# EAGLE design shield_SIM7000E (EAGLE 7.5.0)
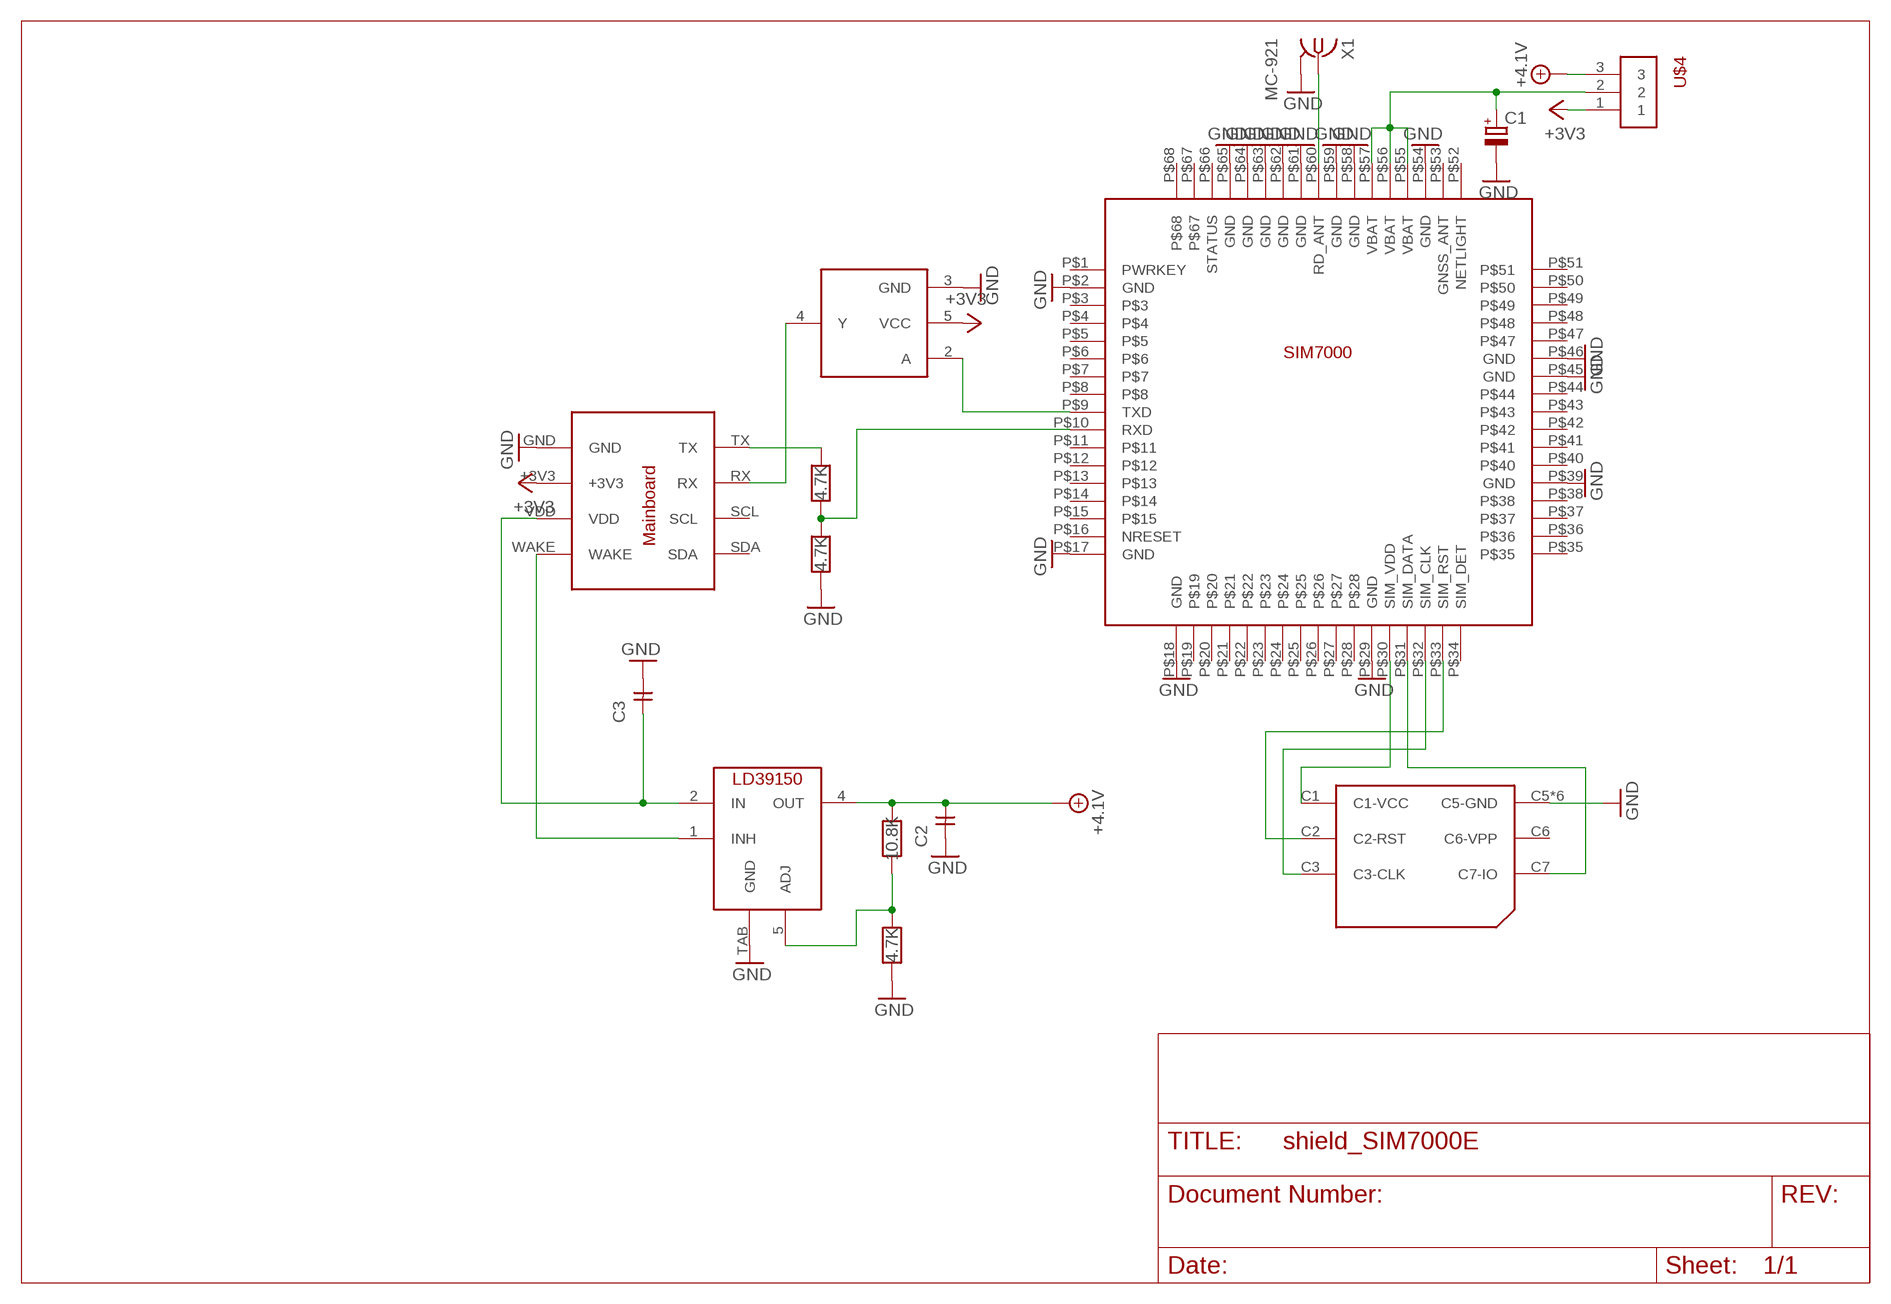
[diagram p0: schematic, sheet 1]

## Parts
C1  CPOL-EUE5-13  [E5-13]
C2  CSMD_1206  [SMD_RC_1206]
C3  CSMD_1206  [SMD_RC_1206]
R1  10.8K  RSMD_1206  [SMD_RC_1206]
R2  4.7K  RSMD_1206  [SMD_RC_1206]
R3  4.7K  RSMD_1206  [SMD_RC_1206]
R4  4.7K  RSMD_1206  [SMD_RC_1206]
U$1  SHIELD  [SHIELD]
U$2  LD39150PT-R  [PPAK]
U$3  SIM7000  [SIM7000]
U$4  HEADER_1X3  [HEADER_1X3]
U$5  SN75LV1T34  [SOT23-5L-SIMPLE]
U$6  SIM_SCYT  [SIM_SCYT]
X1  MC-921  [MC-921]

## Nets
+3V3: U$1.+3V3 U$4.1 U$5.5(VCC)
+4.1V: C2.P$2 R1.P$1 U$2.4(OUT) U$4.3
GND: C1.- C2.P$1 C3.P$2 R2.P$2 R4.P$1 U$1.GND U$2.TAB(GND) U$3.P$2(GND) U$3.P$17(GND) U$3.P$18(GND) U$3.P$29(GND) U$3.P$39(GND) U$3.P$45(GND) U$3.P$46(GND) U$3.P$54(GND) U$3.P$58(GND) U$3.P$59(GND) U$3.P$61(GND) U$3.P$62(GND) U$3.P$63(GND) U$3.P$64(GND) U$3.P$65(GND) U$5.3(GND) U$6.C5(C5-GND) U$6.GND@1(C5-GND) U$6.GND@2(C5-GND) U$6.GND@3(C5-GND) U$6.GND@4(C5-GND) U$6.GND@5(C5-GND) X1.2@1(GND) X1.2@2(GND)
N$1: R3.P$2 U$1.TX
N$2: C1.+ U$3.P$55(VBAT) U$3.P$56(VBAT) U$3.P$57(VBAT) U$4.2
N$3: R1.P$2 R2.P$1 U$2.5(ADJ)
N$4: C3.P$1 U$1.VDD U$2.2(IN)
N$6: U$1.WAKE U$2.1(INH)
N$7: U$3.P$9(TXD) U$5.2(A)
N$8: R3.P$1 R4.P$2 U$3.P$10(RXD)
N$9: U$1.RX U$5.4(Y)
N$10: U$3.P$30(SIM_VDD) U$6.C1(C1-VCC)
N$11: U$3.P$31(SIM_DATA) U$6.C7(C7-IO)
N$12: U$3.P$32(SIM_CLK) U$6.C3(C3-CLK)
N$13: U$3.P$33(SIM_RST) U$6.C2(C2-RST)
N$14: U$3.P$60(RD_ANT) X1.1
Unconnected: U$1.SCL U$1.SDA U$3.P$1(PWRKEY) U$3.P$3 U$3.P$4 U$3.P$5 U$3.P$6 U$3.P$7 U$3.P$8 U$3.P$11 U$3.P$12 U$3.P$13 U$3.P$14 U$3.P$15 U$3.P$16(NRESET) U$3.P$19 U$3.P$20 U$3.P$21 U$3.P$22 U$3.P$23 U$3.P$24 U$3.P$25 U$3.P$26 U$3.P$27 U$3.P$28 U$3.P$34(SIM_DET) U$3.P$35 U$3.P$36 U$3.P$37 U$3.P$38 U$3.P$40 U$3.P$41 U$3.P$42 U$3.P$43 U$3.P$44 U$3.P$47 U$3.P$48 U$3.P$49 U$3.P$50 U$3.P$51 U$3.P$52(NETLIGHT) U$3.P$53(GNSS_ANT) U$3.P$66(STATUS) U$3.P$67 U$3.P$68 U$6.C6(C6-VPP)

## Library data of the parts
C1 = rcl:CPOL-EU: POLARIZED CAPACITOR, European symbol
C2 C3 = balance:C
R1-R4 = balance:R
U$1 = balance:SHIELD
U$2 = balance:LD39150PT-R
U$3 = balance:SIM7000
U$4 = balance:HEADER_1X3
U$5 = balance:SN75LV1T34
U$6 = balance:SIM_SCYT
X1 = con-coax:MC-921: COAX. MICROWAVE CONNECTOR O/D diam 2.1 Source: www.tycoelectronics.com .. Electronics .. ENG_CD_1775146_A2.pdf; OC_FARNELL: unknown; OC_NEWARK: unknown

## Net classes
0 default: clearance 0.205 mm

## Board
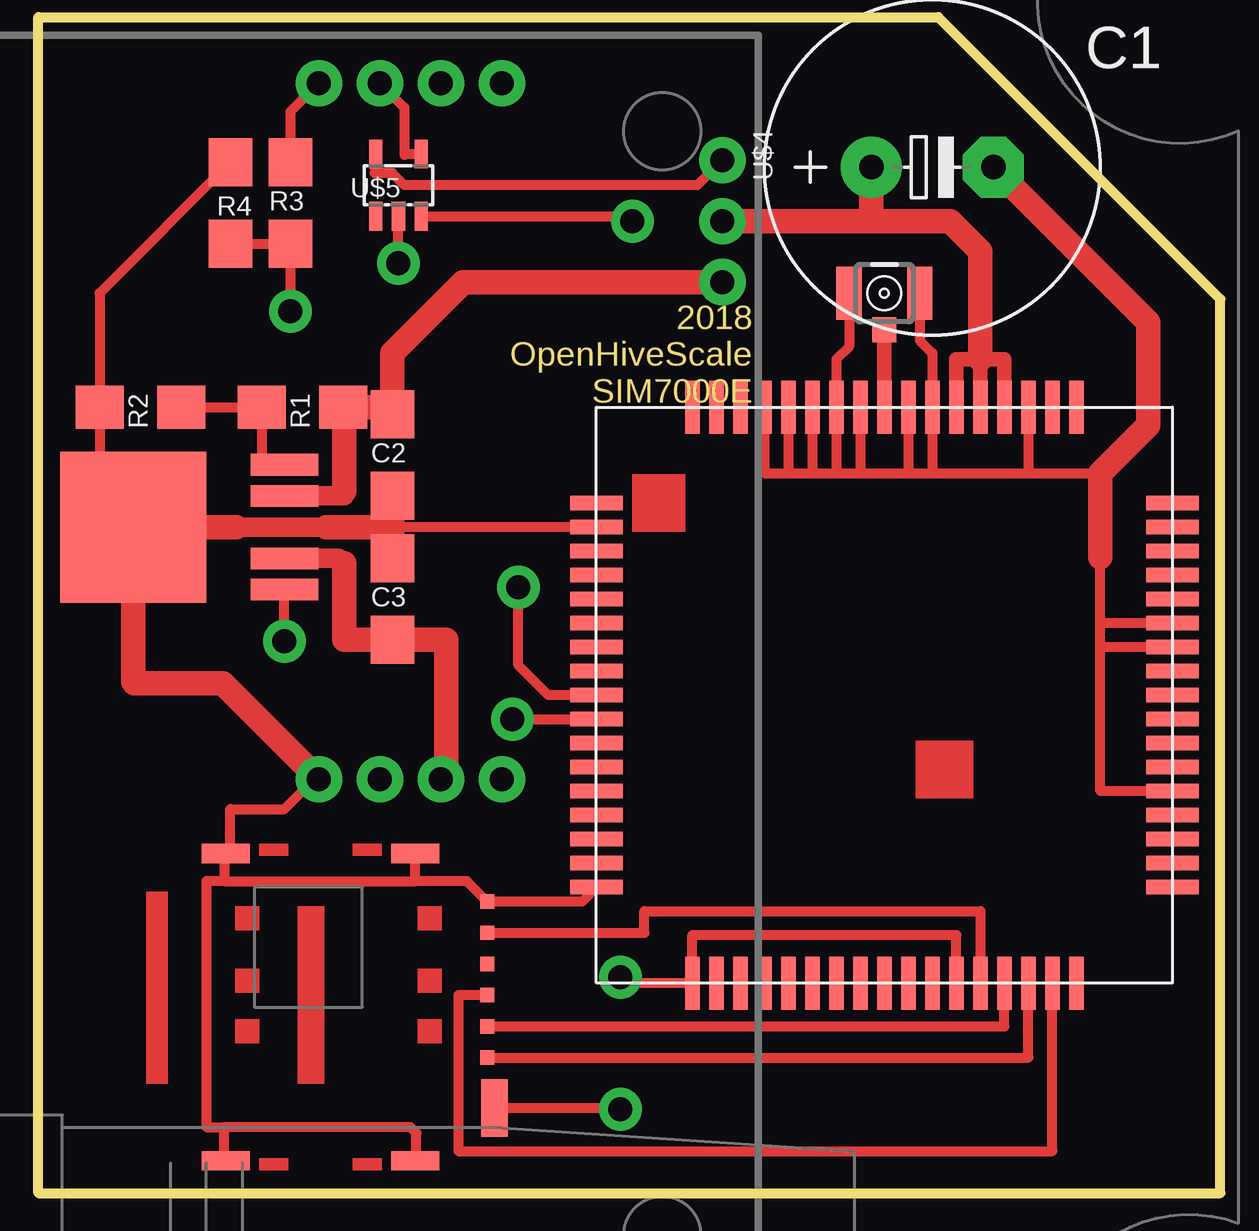
[diagram p1: board, top side]
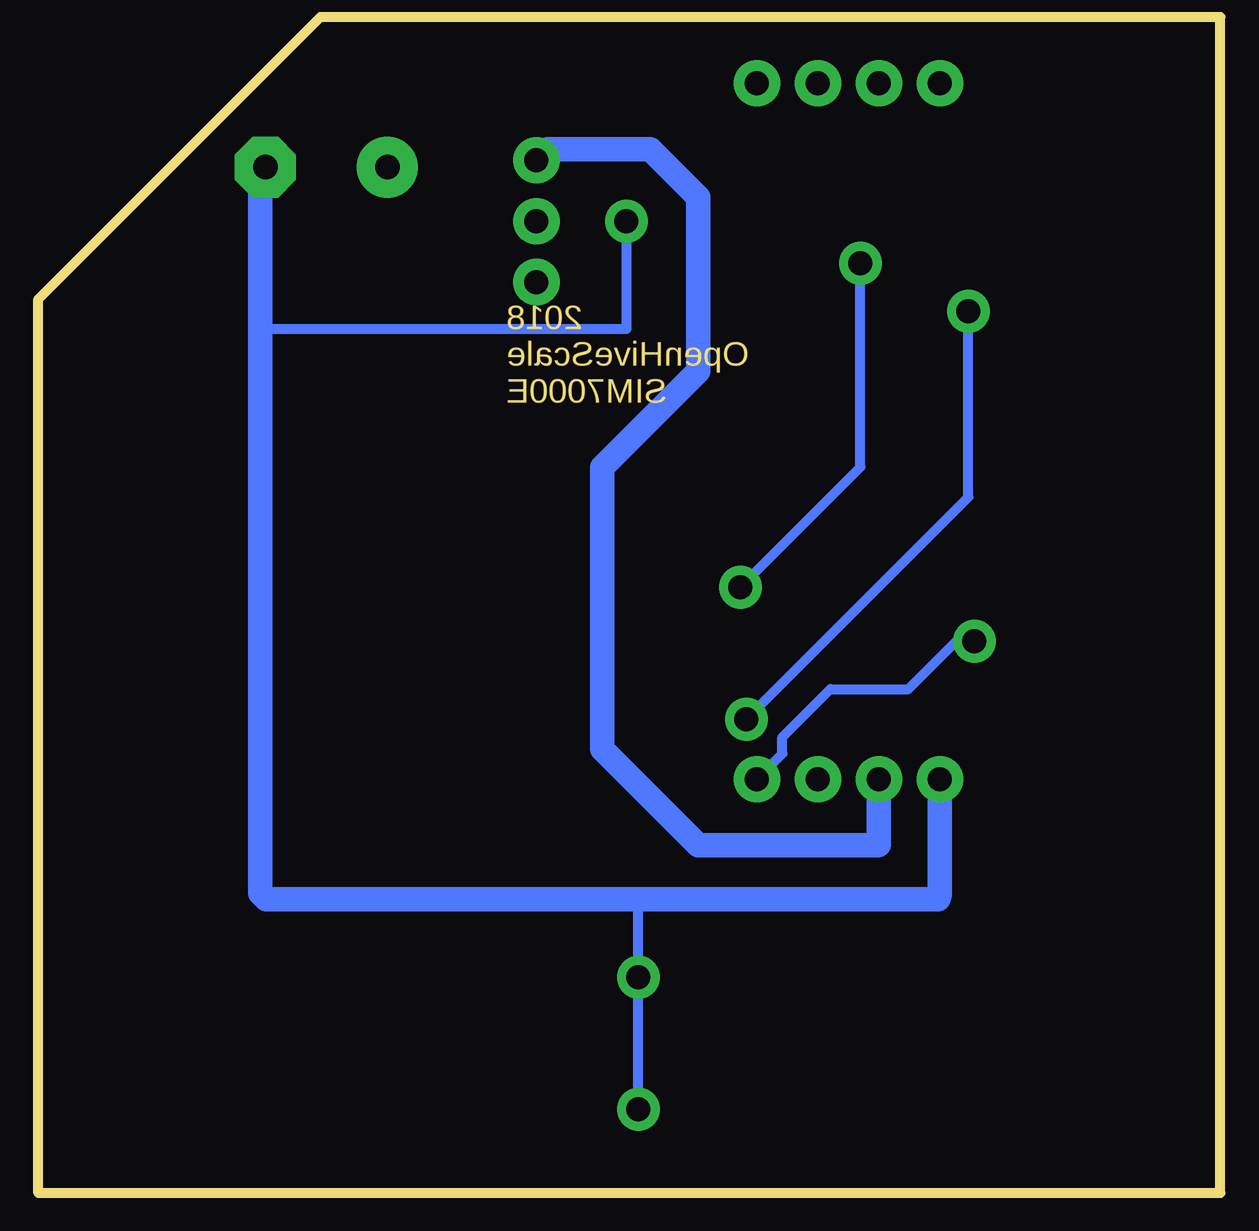
[diagram p2: board, bottom side, seen from below]

No outline drawn. Coordinates in mm, seen from the top.
Copper layers (1*16): Top 0.035mm / dielectric 1.5mm / Bottom 0.035mm
Design rules "SeeedStudio_2layer_DRU_no_angle_20140221": minimum track width 6mil, minimum drill 12mil, track to track 6mil, track to pad 6mil, pad to pad 6mil, via to via 6mil, smd to smd 0mil, copper to edge 10mil, drill to drill 10mil, minimum pad ring 10mil, minimum via ring 6mil, stop-mask expansion 2mil, vias tented up to drill 100mil, thermal gap 10mil
Milling: 5 lines

### Footprints (pad centres in the part's own frame; a part is rotated, then mirrored left to right if it is on the bottom)
E5-13 = drill 1.016 pad 2.54: + -2.54,0 | drill 1.016 pad 2.54 octagon: - 2.54,0
SMD_RC_1206 = smd 2 x 1.8: P$1 -1.7,0; P$2 1.7,0
SHIELD = drill 1 pad 1.93: +3V3 36.73,23; GND 34.19,23; RX 36.73,52; SCL 39.27,52; SDA 41.81,52; TX 34.19,52; VDD 39.27,23; WAKE 41.81,23
PPAK = smd 0.9 x 2.8: 1 -2.6,-4; 2 -1.3,-4; 4 1.3,-4; 5 2.6,-4 | smd 6.3 x 6.1: TAB 0,2.3
SIM7000 = smd 2.2 x 0.6: P$1 -12,8; P$2 -12,7; P$3 -12,6; P$4 -12,5; P$5 -12,4; P$6 -12,3; P$7 -12,2; P$8 -12,1; P$9 -12,0; P$10 -12,-1; P$11 -12,-2; P$12 -12,-3; P$13 -12,-4; P$14 -12,-5; P$15 -12,-6; P$16 -12,-7; P$17 -12,-8; P$35 12,-8; P$36 12,-7; P$37 12,-6; P$38 12,-5; P$39 12,-4; P$40 12,-3; P$41 12,-2; P$42 12,-1; P$43 12,0; P$44 12,1; P$45 12,2; P$46 12,3; P$47 12,4; P$48 12,5; P$49 12,6; P$50 12,7; P$51 12,8 | smd 0.6 x 2.2: P$18 -8,-12; P$19 -7,-12; P$20 -6,-12; P$21 -5,-12; P$22 -4,-12; P$23 -3,-12; P$24 -2,-12; P$25 -1,-12; P$26 0,-12; P$27 1,-12; P$28 2,-12; P$29 3,-12; P$30 4,-12; P$31 5,-12; P$32 6,-12; P$33 7,-12; P$34 8,-12; P$52 8,12; P$53 7,12; P$54 6,12; P$55 5,12; P$56 4,12; P$57 3,12; P$58 2,12; P$59 1,12; P$60 0,12; P$61 -1,12; P$62 -2,12; P$63 -3,12; P$64 -4,12; P$65 -5,12; P$66 -6,12; P$67 -7,12; P$68 -8,12
HEADER_1X3 = drill 1 pad 1.93: 1 -2.54,0; 2 0,0; 3 2.54,0
SOT23-5L-SIMPLE = smd 0.55 x 1.2: 1 -0.95,-1.3; 2 0,-1.3; 3 0.95,-1.3; 4 0.95,1.3; 5 -0.95,1.3
SIM_SCYT = smd 0.6 x 0.6: C1 -3.1,-0.3; C2 -0.5,-0.3; C3 2.1,-0.3; C5 -4.4,-0.3; C6 -1.8,-0.3; C7 0.8,-0.3 | smd 2.4 x 1.1: GND@1 4.2,0 | smd 0.8 x 2: GND@2 -6.4,-3.3; GND@3 6.4,-3.3; GND@4 -6.4,-11.2; GND@5 6.4,-11.2
MC-921 = smd 1 x 1.05: 1 0,1.528 | smd 1.05 x 2.2: 2@1 -1.475,0; 2@2 1.475,0

### Placement (x,y rotation side)
C1  37.25,42.75 0 top
C2  14.75,30.75 90 top
C3  14.75,24.75 90 top
R1  11,32.75 180 top
R2  4.25,32.75 180 top
R3  10.5,41.25 90 top
R4  8,41.25 270 top
U$1  -22.5,-5.75 0 top
U$2  6.25,27.75 90 top
U$3  35.25,20.75 0 top
U$4  28.5,40.5 270 top
U$5  15,42 0 top
U$6  19,7.75 270 top
X1  35.25,37.5 180 top

### Tracks (layer width: path | path; a pad name or v marks a point on that pad's centre or on a via)
+3V3
  Top 0.406: U$4.1 27.46,42 15.25,42 14.75,42.5 14,42.5 14.05,42.55 U$5.5
  Bottom 1.016: U$1.+3V3 14.23,14.52 14.25,14.5 21.75,14.5 25.75,18.5 25.75,30.25 21.75,34.25 21.75,41.5 23.75,43.5 28.04,43.5 U$4.1
+4.1V
  Top 0.813: 12.75,29.25 12.75,29.05 U$2.4
  Top 1.016: 12.75,29.25 12.75,32.5 12.7,32.5 R1.P$1 14.75,32.75 C2.P$2 14.75,35 17.71,37.96 U$4.3
GND  (via drill 1 pad 1.78)
  Top 0.406: 2.55,28 R2.P$2 2.55,37.5 R4.P$1 | 2.55,27.75 U$2.TAB | 7.75,13 7.75,14.1 U$6.GND@4 8,14.35 8,16 10.25,16 11.5,17.25 U$1.GND | 7.75,13 15.75,13 | 15.75,13 15.7,13.05 U$6.GND@2 | 15.75,13 17.85,13 U$6.C5 22.65,12.15 U$3.P$17 | U$6.GND@5 7.75,1.4 7.75,2.75 | U$6.GND@3 15.75,1.4 15.75,2.5 15.5,2.75 7.75,2.75 | U$3.P$46 44.25,23.75 | U$3.P$45 44.25,22.75 | 44.25,22.75 44.25,23.75 | U$3.P$39 44.25,16.75 44.25,22.75 | 44.25,23.75 44.25,26.5 | U$3.P$54 41.25,30 | 41.25,30 44,30 44.25,29.75 | 37.25,30 U$3.P$58 37.25,35 36.73,35.52 X1.2@1 | 37.25,30 41.25,30 | U$3.P$65 30.25,30 31.25,30 | 31.25,30 32.25,30 | 32.25,30 33.25,30 | 33.25,30 34.25,30 | 34.25,30 36.25,30 | U$3.P$64 31.25,30 | U$3.P$63 32.25,30 | 33.25,30 U$3.P$62 33.25,34.75 33.77,35.27 X1.2@2 | U$3.P$61 34.25,30 | U$3.P$59 36.25,30 | 36.25,30 37.25,30 | U$3.P$2 14.75,27.75 | U$5.3 24.8,40.7 v24.75,40.5 | U$3.P$29 38.25,10.75 27.25,10.75 U$3.P$18 24.5,8.75 v24.25,9 | U$6.GND@1 24.2,3.55 v24.25,3.5 | 7.75,13 7,13 7,2.75 7.75,2.75
  Top 0.813: 8.25,27.75 12,27.75
  Top 1.016: 8.25,27.75 U$2.TAB 3.95,21.3 4,21.25 7.69,21.25 U$1.GND | 12,27.75 14.75,27.75 | C3.P$2 14.75,27.75 | 2.55,28.46 2.55,28 2.55,27.75 | C2.P$1 14.75,27.75 | 44.25,26.5 44.25,29.75 44.25,30 46.25,32 46.25,36.29 C1.-
  Bottom 0.406: v24.75,40.5 24.75,36 40,36 | 24.25,12.25 v24.25,9 v24.25,3.5
  Bottom 1.016: C1.- 40,42.54 40,36 40,12.5 39.75,12.25 24.25,12.25 11.75,12.25 11.69,12.44 U$1.GND
N$1
  Top 0.406: U$1.TX 10.5,45.06 R3.P$2
N$2
  Top 0.61: U$3.P$56 39.25,34.75 | U$3.P$57 38.25,34.75 39.25,34.75 | U$3.P$55 40.25,34.75 39.25,34.75
  Top 1.016: U$4.2 34.71,40.5 | 34.71,40.5 C1.+ | 34.71,40.5 38,40.5 39.25,39.25 39.25,34.75
N$3
  Top 0.406: R2.P$1 R1.P$2 9.3,30.35 U$2.5
N$4
  Top 0.813: 12.75,26.25 12.5,26.45 U$2.2
  Top 1.016: 12.75,26.25 12.75,23.05 C3.P$1 17,23.05 17,17.48 U$1.VDD
N$6  (via drill 1 pad 1.78)
  Top 0.406: v10.25,23 U$2.1
  Bottom 0.406: U$1.WAKE 18.25,18.31 18.25,19 16.25,21 13,21 11,23 v10.25,23
N$7  (via drill 1 pad 1.78)
  Top 0.406: U$3.P$9 21.25,20.75 20,22 v20,25.25 | v15,38.75 U$5.2
  Bottom 0.406: v20,25.25 15,30.25 v15,38.75
N$8  (via drill 1 pad 1.78)
  Top 0.406: R4.P$2 R3.P$1 v10.5,36.75 | v19.75,19.75 U$3.P$10
  Bottom 0.406: v19.75,19.75 10.5,29 v10.5,36.75
N$9
  Top 0.406: U$1.RX 15.25,45.23 15.25,43.25 15.3,43.3 U$5.4
N$10
  Top 0.406: U$6.C1 25.25,10.85 25.25,11.75 39.25,11.75 U$3.P$30
N$11
  Top 0.406: U$6.C7 40.25,6.95 U$3.P$31
N$12
  Top 0.406: U$6.C3 41.25,5.65 U$3.P$32
N$13
  Top 0.406: U$6.C2 17.5,8.25 17.5,1.75 42.25,1.75 U$3.P$33
N$14
  Top 0.61: U$3.P$60 X1.1

### Text on the board
Milling: 2018 / OpenHiveScale / SIM7000E